# EAGLE design adsr-op1 (EAGLE 6.6.0)
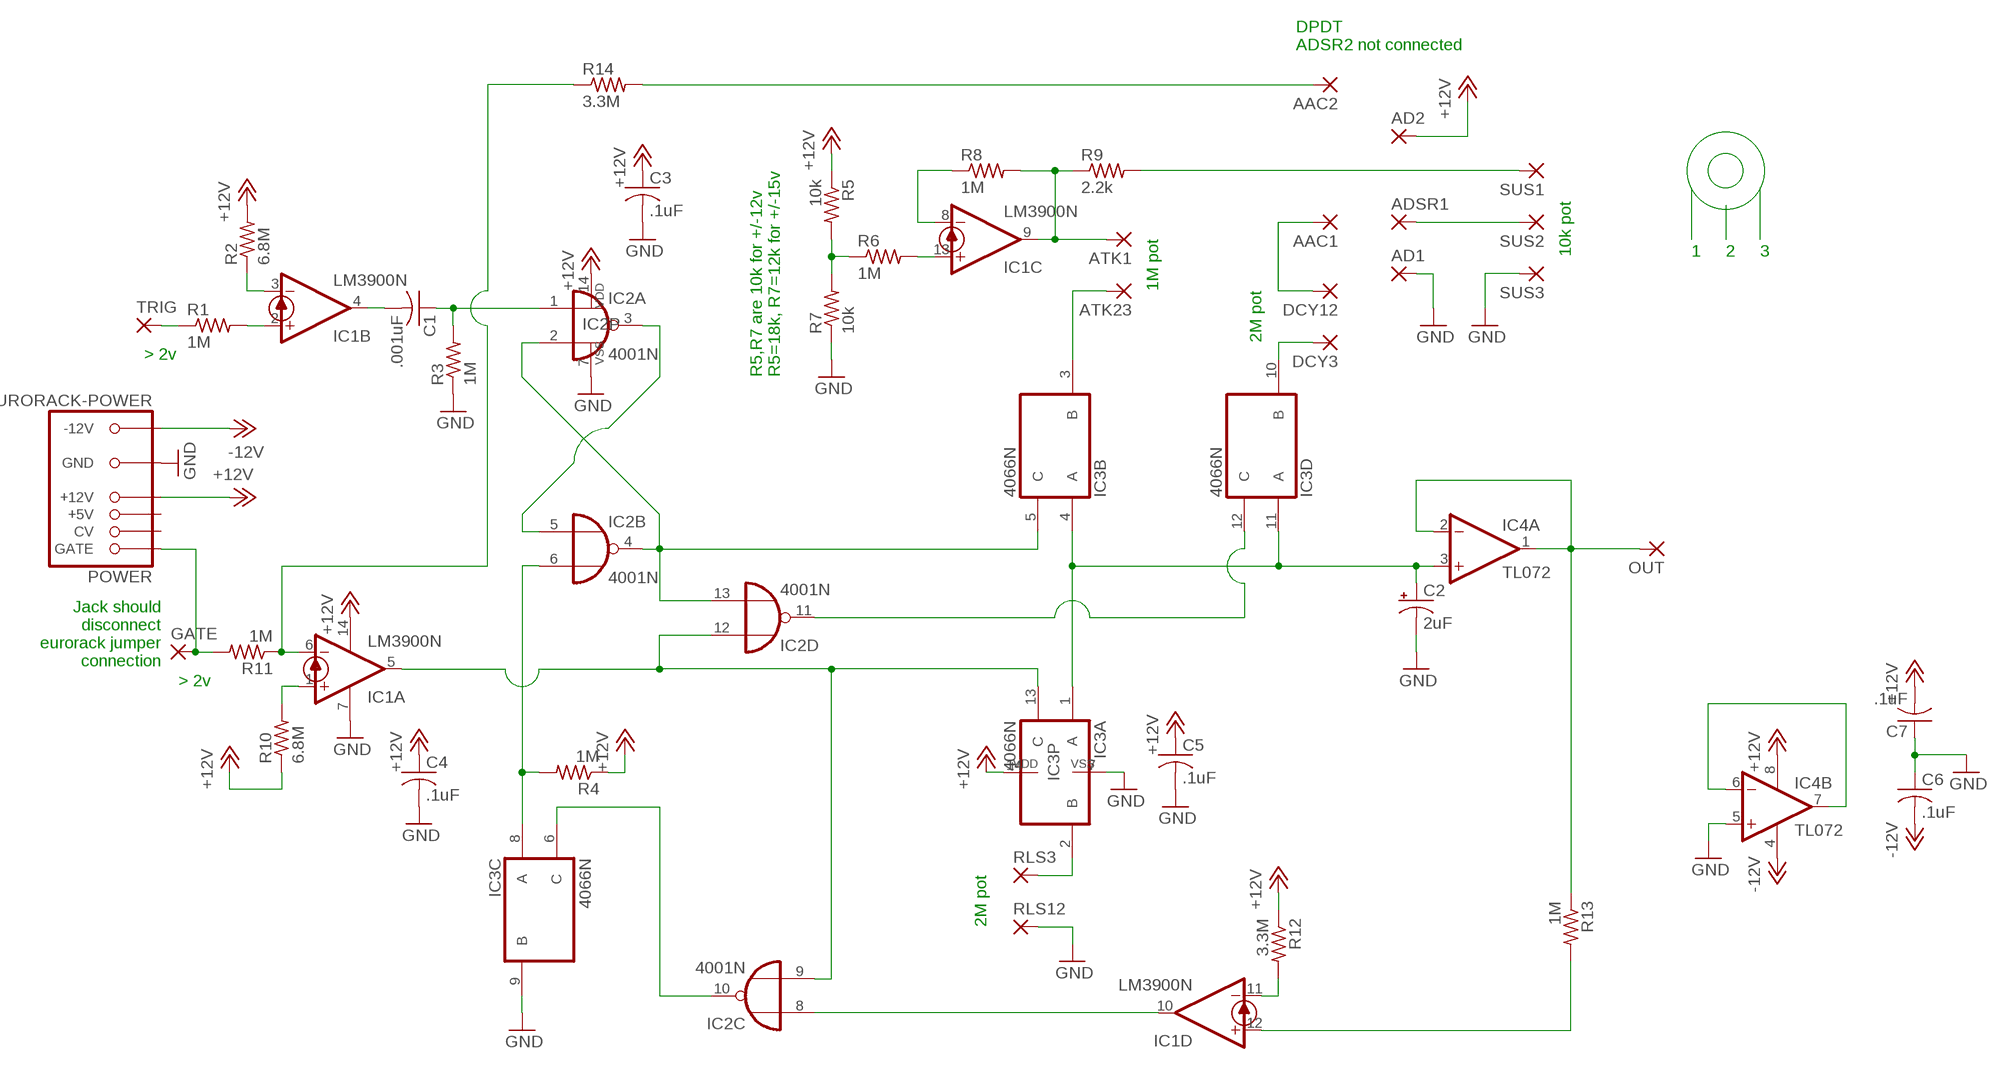
[diagram p0: schematic, sheet 1]

## Parts
AAC1  2,54/1,0  [2,54/1,0]
AAC2  2,54/1,0  [2,54/1,0]
AD1  2,54/1,0  [2,54/1,0]
AD2  2,54/1,0  [2,54/1,0]
ADSR1  2,54/1,0  [2,54/1,0]
ATK1  2,54/1,0  [2,54/1,0]
ATK23  2,54/1,0  [2,54/1,0]
C1  .001uF  C-US050-025X075  [C050-025X075]
C2  2uF  CPOL-USE2.5-5  [E2,5-5]
C3  .1uF  C-US050-025X075  [C050-025X075]
C4  .1uF  C-US050-025X075  [C050-025X075]
C5  .1uF  C-US050-025X075  [C050-025X075]
C6  .1uF  C-US050-025X075  [C050-025X075]
C7  .1uF  C-US050-025X075  [C050-025X075]
DCY3  2,54/1,0  [2,54/1,0]
DCY12  2,54/1,0  [2,54/1,0]
GATE  2,54/1,0  [2,54/1,0]
IC1  LM3900N  [DIL14]
IC2  4001N  [DIL14]
IC3  4066N  [DIL14]
IC4  TL072  TL072-TOPP  [DIL08]
OUT  2,54/1,0  [2,54/1,0]
POWER  EURORACK-POWER  [PINSHRD_PTH_2X8]
R1  1M  R-US_0207/10  [0207/10]
R2  6.8M  R-US_0207/10  [0207/10]
R3  1M  R-US_0207/10  [0207/10]
R4  1M  R-US_0207/10  [0207/10]
R5  10k  R-US_0207/10  [0207/10]
R6  1M  R-US_0207/10  [0207/10]
R7  10k  R-US_0207/10  [0207/10]
R8  1M  R-US_0207/10  [0207/10]
R9  2.2k  R-US_0207/10  [0207/10]
R10  6.8M  R-US_0207/10  [0207/10]
R11  1M  R-US_0207/10  [0207/10]
R12  3.3M  R-US_0207/10  [0207/10]
R13  1M  R-US_0207/10  [0207/10]
R14  3.3M  R-US_0207/10  [0207/10]
RLS3  2,54/1,0  [2,54/1,0]
RLS12  2,54/1,0  [2,54/1,0]
SUS1  2,54/1,0  [2,54/1,0]
SUS2  2,54/1,0  [2,54/1,0]
SUS3  2,54/1,0  [2,54/1,0]
TRIG  2,54/1,0  [2,54/1,0]

## Nets
+12V: AD2.1(P) C3.1 C4.1 C5.1 C7.2 IC1.14(P:V+) IC2.14(P:VDD) IC3.14(P:VDD) IC4.8(P:V+) POWER.+12V@1(+12V) POWER.+12V@2(+12V) R2.2 R4.1 R5.1 R10.1 R12.1
-12V: C6.2 IC4.4(P:V-) POWER.-12V@1(-12V) POWER.-12V@2(-12V)
GND: AD1.1(P) C2.- C3.2 C4.2 C5.2 C6.1 C7.1 IC1.7(P:GND) IC2.7(P:VSS) IC3.7(P:VSS) IC3.9(C:B) IC4.5(B:+IN) POWER.GND@1(GND) POWER.GND@2(GND) POWER.GND@3(GND) POWER.GND@4(GND) POWER.GND@5(GND) POWER.GND@6(GND) R3.1 R7.1 RLS12.1(P) SUS3.1(P)
N$1: IC4.6(B:-IN) IC4.7(B:OUT)
N$2: IC1.3(B:-IN) R2.1
N$3: IC1.2(B:+IN) R1.2
N$4: R1.1 TRIG.1(P)
N$5: C1.2 IC1.4(B:OUT)
N$6: C1.1 IC2.1(A:I0) R3.2
N$7: IC2.2(A:I1) IC2.4(B:O) IC2.13(D:I1) IC3.5(B:C)
N$8: IC2.3(A:O) IC2.5(B:I0)
N$9: IC1.6(A:-IN) R11.1 R14.1
N$10: IC1.1(A:+IN) R10.2
N$11: IC2.10(C:O) IC3.6(C:C)
N$12: GATE.1(P) POWER.GATE@1(GATE) POWER.GATE@2(GATE) R11.2
N$13: IC2.6(B:I1) IC3.8(C:A) R4.2
N$14: IC1.5(A:OUT) IC2.9(C:I1) IC2.12(D:I0) IC3.13(A:C)
N$15: IC1.10(D:OUT) IC2.8(C:I0)
N$16: IC3.2(A:B) RLS3.1(P)
N$18: IC1.11(D:-IN) R12.2
N$19: C2.+ IC3.1(A:A) IC3.4(B:A) IC3.11(D:A) IC4.3(A:+IN)
N$20: ATK23.1(P) IC3.3(B:B)
N$21: ATK1.1(P) IC1.9(C:OUT) R8.2 R9.1
N$22: IC1.13(C:+IN) R6.2
N$23: R5.2 R6.1 R7.2
N$24: IC1.8(C:-IN) R8.1
N$25: IC2.11(D:O) IC3.12(D:C)
N$26: DCY3.1(P) IC3.10(D:B)
N$27: AAC1.1(P) DCY12.1(P)
N$28: ADSR1.1(P) SUS2.1(P)
N$29: R9.2 SUS1.1(P)
N$30: AAC2.1(P) R14.2
N$32: IC4.1(A:OUT) IC4.2(A:-IN) OUT.1(P) R13.1
N$34: IC1.12(D:+IN) R13.2
Unconnected: POWER.+5V@1(+5V) POWER.+5V@2(+5V) POWER.CV@1(CV) POWER.CV@2(CV)

## Notes on the sheet
- DPDT
  ADSR2 not connected
- 10k pot | 1 | 2 | 3
- 1M pot
- 2M pot
- > 2v
- R5,R7 are 10k for +/-12v
  R5=18k, R7=12k for +/-15v
- Jack should
  disconnect
  eurorack jumper
  connection
- > 2v
- 2M pot

## Library data of the parts
AAC1 AAC2 AD1 AD2 ADSR1 ATK1 ATK23 DCY3 DCY12 GATE OUT RLS3 RLS12 SUS1-SUS3 TRIG = wirepad:2,54/1,0: THROUGH-HOLE PAD
C1 C3-C7 = rcl:C-US: CAPACITOR, American symbol
C2 = rcl:CPOL-US: POLARIZED CAPACITOR, American symbol
IC1 = linear:LM3900: OP AMP
IC2 = 40xx:4001: Quad 2-input NOR
IC3 = 40xx:4066: Quad bilateral ANALOG SWITCH
IC4 = mmoretti:TL072-TOP: OP AMP
POWER = mmoretti:EURORACK-POWER
R1-R14 = rcl:R-US_: RESISTOR, American symbol

## Board
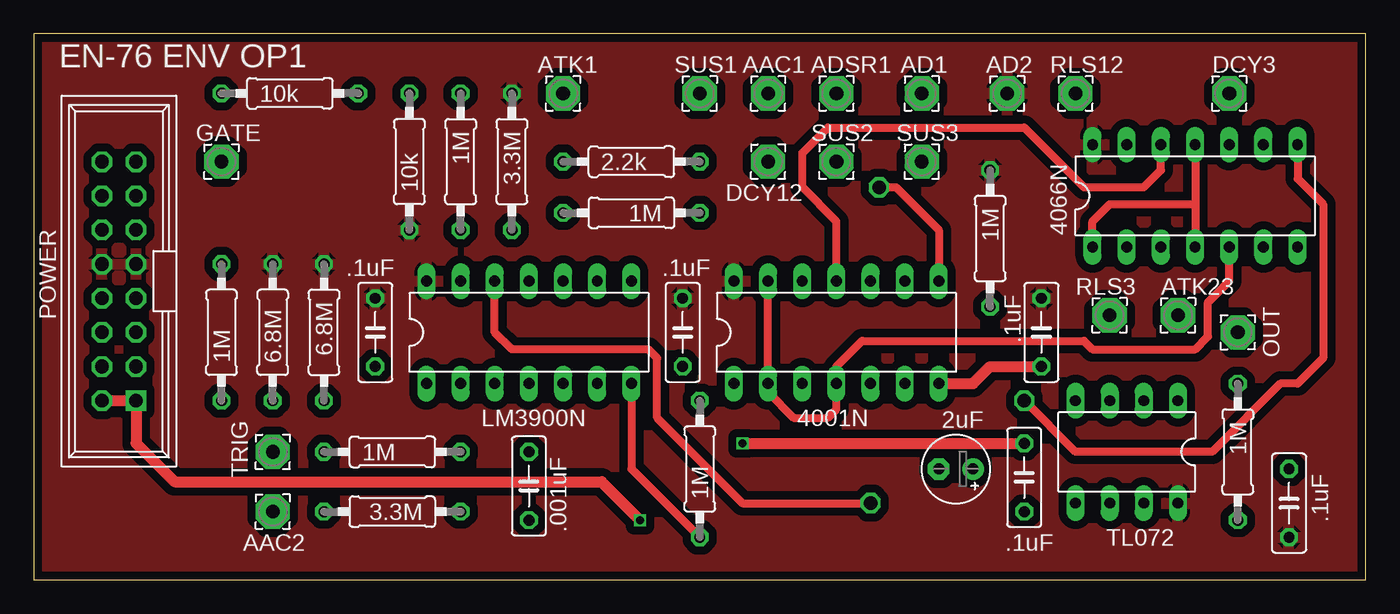
[diagram p1: board, top side]
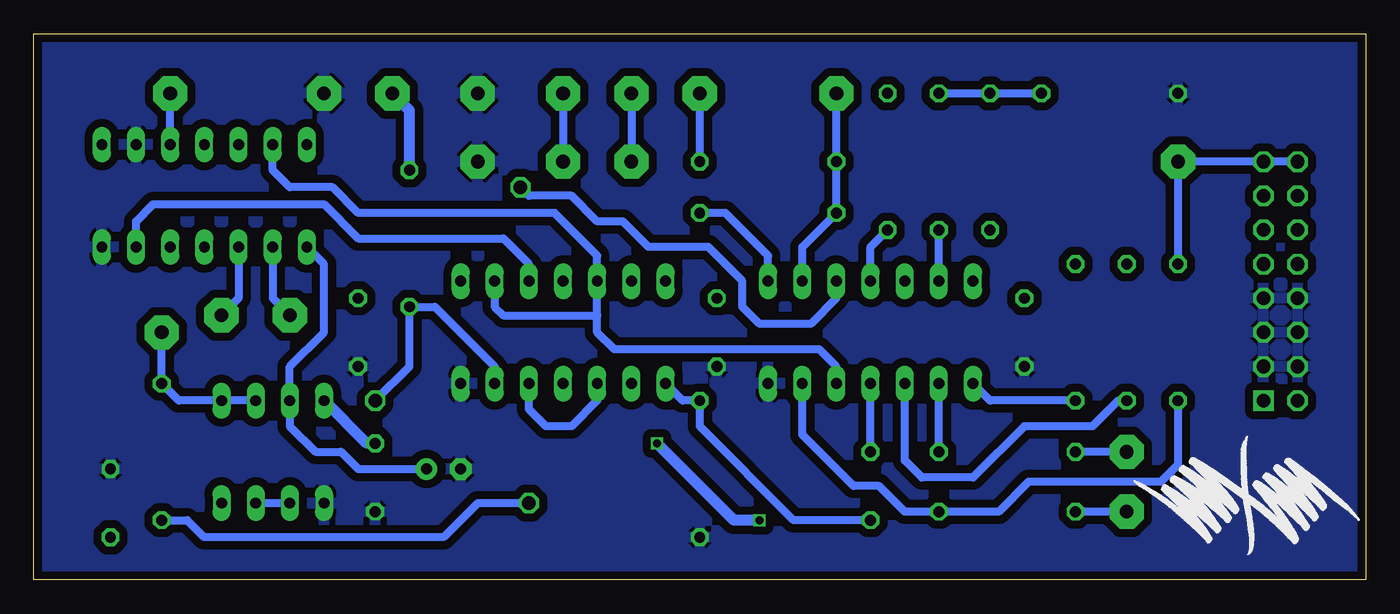
[diagram p2: board, bottom side, seen from below]

Size 99.06 x 40.64 mm. Coordinates in mm from the lower left corner, seen from the top.
Outline: 0,0 99.04,0 99.06,40.64 0,40.64 0,0
Copper layers (1*16): Top 0.035mm / dielectric 1.5mm / Bottom 0.035mm
Design rules "SeeedStudio_2layer_DRU_no_angle_20140221": minimum track width 6mil, minimum drill 12mil, track to track 6mil, track to pad 6mil, pad to pad 6mil, via to via 6mil, smd to smd 0mil, copper to edge 10mil, drill to drill 10mil, minimum pad ring 10mil, minimum via ring 6mil, stop-mask expansion 2mil, vias tented up to drill 100mil, thermal gap 10mil

### Footprints (pad centres in the part's own frame; a part is rotated, then mirrored left to right if it is on the bottom)
2,54/1,0 = drill 1.016 pad 2.54 octagon: 1 0,0
C050-025X075 = drill 0.813 octagon: 1 -2.54,0; 2 2.54,0
E2,5-5 = drill 0.813 pad 1.6: + -1.27,0 | drill 0.813 pad 1.6 octagon: - 1.27,0
DIL14 = drill 0.813 long: 1 -7.62,-3.81; 2 -5.08,-3.81; 3 -2.54,-3.81; 4 0,-3.81; 5 2.54,-3.81; 6 5.08,-3.81; 7 7.62,-3.81; 8 7.62,3.81; 9 5.08,3.81; 10 2.54,3.81; 11 0,3.81; 12 -2.54,3.81; 13 -5.08,3.81; 14 -7.62,3.81
DIL08 = drill 0.813 long: 1 -3.81,-3.81; 2 -1.27,-3.81; 3 1.27,-3.81; 4 3.81,-3.81; 5 3.81,3.81; 6 1.27,3.81; 7 -1.27,3.81; 8 -3.81,3.81
PINSHRD_PTH_2X8 = drill 1.016 octagon: +5V@1 3.81,1.27; +5V@2 3.81,-1.27; +12V@1 1.27,1.27; +12V@2 1.27,-1.27; -12V@1 -8.89,1.27; CV@1 6.35,1.27; CV@2 6.35,-1.27; GATE@1 8.89,1.27; GATE@2 8.89,-1.27; GND@1 -6.35,1.27; GND@2 -6.35,-1.27; GND@3 -3.81,1.27; GND@4 -3.81,-1.27; GND@5 -1.27,1.27; GND@6 -1.27,-1.27 | drill 1.016 square: -12V@2 -8.89,-1.27
0207/10 = drill 0.813 octagon: 1 -5.08,0; 2 5.08,0

### Placement (x,y rotation side)
AAC1  54.61,36.2 0 top
AAC2  17.78,5.08 0 top
AD1  66.04,36.2 0 top
AD2  72.39,36.2 0 top
ADSR1  59.69,36.2 0 top
ATK1  39.37,36.2 0 top
ATK23  85.09,19.68 0 top
C1  36.83,6.99 90 top
C2  68.58,8.26 180 top
C3  48.26,18.41 270 top
C4  25.4,18.41 270 top
C5  74.93,18.41 270 top
C6  73.66,7.62 90 top
C7  93.34,5.71 270 top
DCY3  88.9,36.2 0 top
DCY12  54.61,31.11 0 top
GATE  13.97,31.11 0 top
IC1  36.83,18.41 0 top
IC2  59.69,18.41 0 top
IC3  86.36,28.57 0 top
IC4  81.28,9.53 180 top
OUT  89.53,18.41 180 top
POWER  6.35,22.23 90 top
R1  26.67,9.53 0 top
R2  17.78,18.41 90 top
R3  49.53,8.26 90 top
R4  71.12,25.4 270 top
R5  27.94,31.11 90 top
R6  31.75,31.11 270 top
R7  19.05,36.2 0 top
R8  44.45,27.3 180 top
R9  44.45,31.11 0 top
R10  21.59,18.41 270 top
R11  13.97,18.41 90 top
R12  35.56,31.11 270 top
R13  89.53,9.53 270 top
R14  26.67,5.08 180 top
RLS3  80.01,19.68 0 top
RLS12  77.47,36.2 0 top
SUS1  49.53,36.2 0 top
SUS2  59.69,31.11 0 top
SUS3  66.04,31.11 0 top
TRIG  17.78,9.53 0 top

### Tracks (layer width: path | path; a pad name or v marks a point on that pad's centre or on a via)
+12V
  Bottom 0.813: R4.1 71.12,34.92 AD2.1
  pour Top (isolate 0.61, rank 2): 0,40.64 99.06,40.64 99.06,0 0,0
-12V  (via drill 0.6)
  Top 0.813: POWER.-12V@1 POWER.-12V@2 7.62,10.16 10.48,7.3 42.23,7.3 v45.09,4.45 | v52.7,10.16 C6.2
  Bottom 0.813: v45.09,4.45 46.99,4.45 v52.7,10.16 | C6.2 74.3,10.16 IC4.4
GND
  Top 0.61: IC1.7 44.45,8.26 R3.1
  Top 0.813: IC2.7 69.85,14.61 71.12,15.88 C5.2
  pour Bottom (isolate 0.61): 0,40.64 99.06,40.64 99.06,0 0,0
N$1
  Bottom 0.61: IC4.6 IC4.7
N$2
  Bottom 0.61: R2.1 18.41,13.34 20.32,11.43 25.4,11.43 29.21,7.62 33.02,7.62 34.29,8.89 IC1.3
N$3
  Bottom 0.61: R1.2 IC1.2
N$4
  Bottom 0.61: TRIG.1 R1.1
N$5
  Bottom 0.61: C1.2 IC1.4
N$6
  Bottom 0.61: C1.1 42.55,4.45 49.53,11.43 R3.2 50.8,13.34 IC2.1
N$7
  Top 0.61: IC2.13 IC2.2 54.61,13.97 56.52,12.06 59.05,12.06 59.69,12.7 IC2.4 59.69,15.88 61.59,17.78 78.11,17.78 78.74,17.14 86.36,17.14 87.31,18.1 87.31,20.64 88.9,22.23 IC3.5
N$8
  Bottom 0.61: IC2.3 57.15,13.34 59.05,11.43 60.96,11.43 62.23,12.7 IC2.5
N$9
  Bottom 0.61: R11.1 13.97,8.57 15.24,7.3 25.08,7.3 27.3,5.08 R14.1 34.29,5.08 36.2,6.99 38.1,6.99 41.91,10.79 IC1.6
N$10
  Bottom 0.61: R10.2 27.94,13.34 IC1.1
N$11
  Bottom 0.61: IC3.6 91.44,26.67 90.17,27.94 77.47,27.94 74.93,25.4 64.14,25.4 62.23,23.5 IC2.10
N$12
  Bottom 0.61: POWER.GATE@1 POWER.GATE@2 GATE.1 R11.2
N$13  (via drill 1)
  Top 0.61: IC3.8 93.98,29.84 95.89,27.94 95.89,16.51 93.98,14.61 92.71,14.61 87.63,9.53 77.47,9.53 v73.66,13.34
  Bottom 0.61: IC2.6 64.77,15.88 69.22,20.32 R4.2 71.12,15.88 v73.66,13.34
N$14
  Bottom 0.61: IC1.5 39.37,15.88 40.64,17.14 55.88,17.14 57.15,18.41 57.15,19.68 | 57.15,19.68 IC2.12 57.15,24.13 60.33,27.3 74.93,27.3 76.83,29.21 80.01,29.21 81.28,30.48 IC3.13 | IC2.9 64.77,20.32 64.14,19.68 57.15,19.68
N$15  (via drill 1)
  Top 0.61: v62.87,29.21 64.14,29.21 67.31,26.04 IC2.8
  Bottom 0.61: IC1.10 39.37,20.95 41.27,19.05 45.09,19.05 46.35,20.32 46.35,22.23 48.9,24.77 53.34,24.77 55.24,26.67 57.15,26.67 59.05,28.57 62.23,28.57 v62.87,29.21
N$16
  Bottom 0.61: IC3.2 81.28,20.95 RLS3.1
N$18
  Bottom 0.61: IC1.11 36.83,24.77 R12.2
N$19
  Top 0.61: IC3.11 86.36,27.94 | 86.36,27.94 IC3.4 | IC3.1 78.74,26.67 80.01,27.94 86.36,27.94
  Bottom 0.61: IC3.1 77.47,23.5 77.47,18.41 80.01,15.88 IC4.3 80.01,11.43 78.11,9.53 76.2,9.53 74.93,8.26 C2.+
N$20
  Bottom 0.61: IC3.3 83.82,20.95 ATK23.1
N$21
  Bottom 0.61: IC1.9 41.91,24.77 R8.2 R9.1 ATK1.1
N$22
  Bottom 0.61: IC1.13 R6.2
N$23
  Bottom 0.61: R6.1 R5.2 R7.2
N$24
  Bottom 0.61: IC1.8 44.45,24.13 47.62,27.3 R8.1
N$25
  Top 0.61: IC2.11 59.69,26.67 57.15,29.21 57.15,31.75 59.05,33.66 73.66,33.66 78.11,29.21 82.55,29.21 83.82,30.48 IC3.12
N$26
  Bottom 0.61: IC3.10 DCY3.1
N$27
  Bottom 0.61: AAC1.1 DCY12.1
N$28
  Bottom 0.61: ADSR1.1 SUS2.1
N$29
  Bottom 0.61: R9.2 SUS1.1
N$30
  Bottom 0.61: AAC2.1 R14.2
N$32
  Bottom 0.61: IC4.2 IC4.1 88.27,13.34 R13.1 OUT.1
N$34  (via drill 1)
  Top 0.61: IC1.12 34.29,18.41 35.56,17.14 45.72,17.14 46.35,16.51 46.35,12.06 52.7,5.71 v62.23,5.71
  Bottom 0.61: R13.2 87.63,4.45 86.36,3.17 68.58,3.17 66.04,5.71 v62.23,5.71

### Text on the board
tPlace: EN-76 ENV OP1